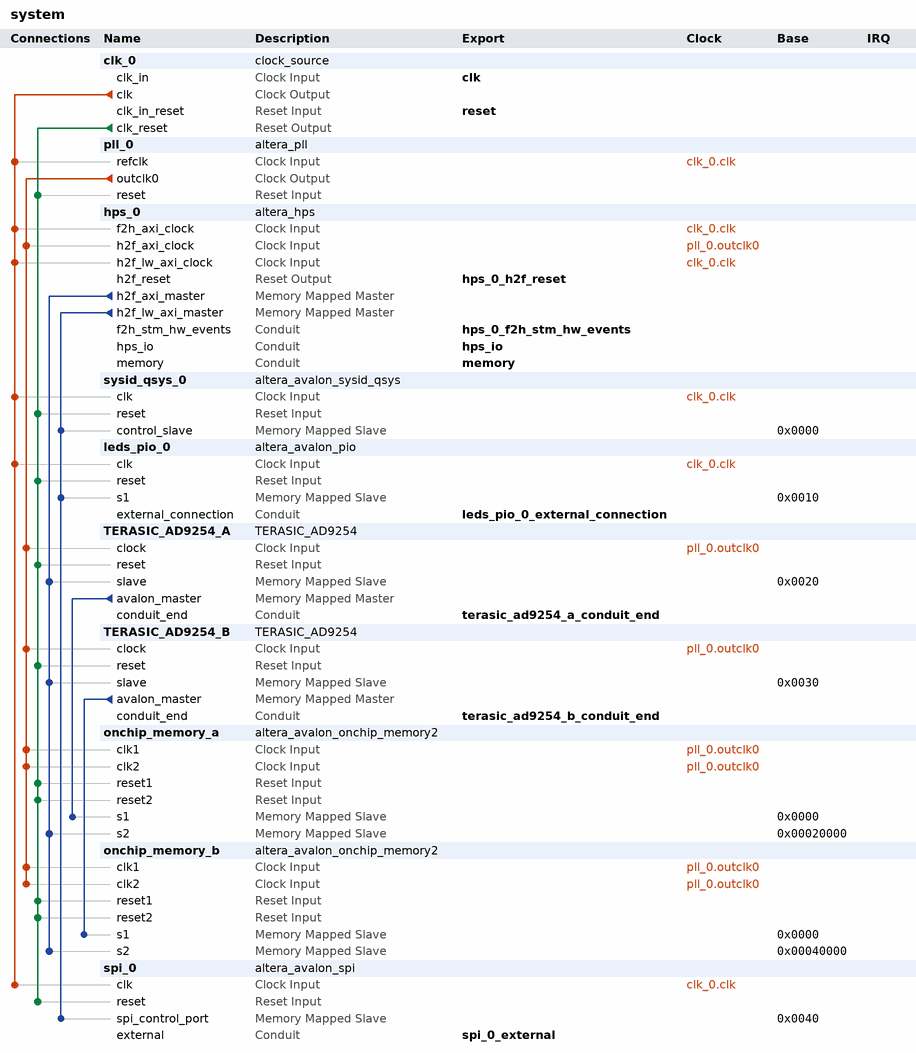
[diagram p0: system contents]
# Platform Designer (Qsys) system system, Cyclone V 5CSEMA4U23C6
# Parameters at their usual value, and those the tool derives, are not listed.
package require -exact qsys 17.1
create_system system
set_project_property DEVICE_FAMILY {Cyclone V}
set_project_property DEVICE 5CSEMA4U23C6

add_instance clk_0 clock_source 17.1
set_instance_parameter_value clk_0 clockFrequency 50000000

add_instance pll_0 altera_pll 17.1
set_instance_parameter_value pll_0 gui_device_speed_grade 2
set_instance_parameter_value pll_0 gui_number_of_clocks 1
set_instance_parameter_value pll_0 gui_operation_mode direct
set_instance_parameter_value pll_0 gui_output_clock_frequency0 100.0
set_instance_parameter_value pll_0 gui_pll_mode {Integer-N PLL}
set_instance_parameter_value pll_0 gui_reference_clock_frequency 50.0
set_instance_parameter_value pll_0 gui_use_locked false

add_instance hps_0 altera_hps 17.1
set_instance_parameter_value hps_0 EMAC1_Mode RGMII
set_instance_parameter_value hps_0 EMAC1_PinMuxing {HPS I/O Set 0}
set_instance_parameter_value hps_0 F2SCLK_COLDRST_Enable false
set_instance_parameter_value hps_0 F2SCLK_DBGRST_Enable false
set_instance_parameter_value hps_0 F2SCLK_WARMRST_Enable false
set_instance_parameter_value hps_0 F2SINTERRUPT_Enable false
set_instance_parameter_value hps_0 F2S_Width 1
set_instance_parameter_value hps_0 FPGA_PERIPHERAL_OUTPUT_CLOCK_FREQ_EMAC0_GTX_CLK 125
set_instance_parameter_value hps_0 FPGA_PERIPHERAL_OUTPUT_CLOCK_FREQ_EMAC0_MD_CLK 2.5
set_instance_parameter_value hps_0 FPGA_PERIPHERAL_OUTPUT_CLOCK_FREQ_EMAC1_GTX_CLK 125
set_instance_parameter_value hps_0 FPGA_PERIPHERAL_OUTPUT_CLOCK_FREQ_EMAC1_MD_CLK 2.5
set_instance_parameter_value hps_0 HPS_PROTOCOL DDR3
set_instance_parameter_value hps_0 I2C0_Mode N/A
set_instance_parameter_value hps_0 I2C0_PinMuxing Unused
set_instance_parameter_value hps_0 I2C1_Mode N/A
set_instance_parameter_value hps_0 I2C1_PinMuxing Unused
set_instance_parameter_value hps_0 LWH2F_Enable true
set_instance_parameter_value hps_0 MEM_BANKADDR_WIDTH 3
set_instance_parameter_value hps_0 MEM_CLK_FREQ 400.0
set_instance_parameter_value hps_0 MEM_COL_ADDR_WIDTH 10
set_instance_parameter_value hps_0 MEM_DQ_WIDTH 32
set_instance_parameter_value hps_0 MEM_DRV_STR RZQ/6
set_instance_parameter_value hps_0 MEM_ROW_ADDR_WIDTH 15
set_instance_parameter_value hps_0 MEM_RTT_NOM RZQ/6
set_instance_parameter_value hps_0 MEM_RTT_WR {Dynamic ODT off}
set_instance_parameter_value hps_0 MEM_TCL 7
set_instance_parameter_value hps_0 MEM_TFAW_NS 37.5
set_instance_parameter_value hps_0 MEM_TRAS_NS 35.0
set_instance_parameter_value hps_0 MEM_TRCD_NS 13.75
set_instance_parameter_value hps_0 MEM_TRFC_NS 300.0
set_instance_parameter_value hps_0 MEM_TRP_NS 13.75
set_instance_parameter_value hps_0 MEM_VENDOR Other
set_instance_parameter_value hps_0 MEM_WTCL 7
set_instance_parameter_value hps_0 QSPI_Mode N/A
set_instance_parameter_value hps_0 QSPI_PinMuxing Unused
set_instance_parameter_value hps_0 REF_CLK_FREQ 25.0
set_instance_parameter_value hps_0 S2FCLK_USER2CLK 5
set_instance_parameter_value hps_0 S2F_Width 1
set_instance_parameter_value hps_0 SDIO_Mode {4-bit Data}
set_instance_parameter_value hps_0 SDIO_PinMuxing {HPS I/O Set 0}
set_instance_parameter_value hps_0 SPIM1_Mode N/A
set_instance_parameter_value hps_0 SPIM1_PinMuxing Unused
set_instance_parameter_value hps_0 STM_Enable true
set_instance_parameter_value hps_0 TIMING_BOARD_AC_SKEW 0.02
set_instance_parameter_value hps_0 TIMING_BOARD_AC_TO_CK_SKEW 0.0
set_instance_parameter_value hps_0 TIMING_BOARD_DQ_TO_DQS_SKEW 0.0
set_instance_parameter_value hps_0 TIMING_BOARD_MAX_CK_DELAY 0.6
set_instance_parameter_value hps_0 TIMING_BOARD_MAX_DQS_DELAY 0.6
set_instance_parameter_value hps_0 TIMING_BOARD_SKEW_BETWEEN_DQS 0.02
set_instance_parameter_value hps_0 TIMING_BOARD_SKEW_CKDQS_DIMM_MAX 0.01
set_instance_parameter_value hps_0 TIMING_BOARD_SKEW_CKDQS_DIMM_MIN -0.01
set_instance_parameter_value hps_0 TIMING_BOARD_SKEW_WITHIN_DQS 0.02
set_instance_parameter_value hps_0 TIMING_TDH 125
set_instance_parameter_value hps_0 TIMING_TDQSCK 400
set_instance_parameter_value hps_0 TIMING_TDQSQ 120
set_instance_parameter_value hps_0 TIMING_TDS 50
set_instance_parameter_value hps_0 TIMING_TIH 250
set_instance_parameter_value hps_0 TIMING_TIS 175
set_instance_parameter_value hps_0 TIMING_TQSH 0.38
set_instance_parameter_value hps_0 UART0_Mode {No Flow Control}
set_instance_parameter_value hps_0 UART0_PinMuxing {HPS I/O Set 0}
set_instance_parameter_value hps_0 USB1_Mode N/A
set_instance_parameter_value hps_0 USB1_PinMuxing Unused
set_instance_parameter_value hps_0 desired_cfg_clk_mhz 100.0
set_instance_parameter_value hps_0 desired_qspi_clk_mhz 400.0

add_instance sysid_qsys_0 altera_avalon_sysid_qsys 17.1
set_instance_parameter_value sysid_qsys_0 id 18351138

add_instance leds_pio_0 altera_avalon_pio 17.1
set_instance_parameter_value leds_pio_0 direction Output
set_instance_parameter_value leds_pio_0 resetValue 170
set_instance_parameter_value leds_pio_0 width 8

add_instance TERASIC_AD9254_A TERASIC_AD9254 1.0

add_instance TERASIC_AD9254_B TERASIC_AD9254 1.0

add_instance onchip_memory_a altera_avalon_onchip_memory2 17.1
set_instance_parameter_value onchip_memory_a dataWidth 16
set_instance_parameter_value onchip_memory_a dualPort true
set_instance_parameter_value onchip_memory_a initMemContent false
set_instance_parameter_value onchip_memory_a initializationFileName onchip_mem.hex
set_instance_parameter_value onchip_memory_a memorySize 100000

add_instance onchip_memory_b altera_avalon_onchip_memory2 17.1
set_instance_parameter_value onchip_memory_b dataWidth 16
set_instance_parameter_value onchip_memory_b dualPort true
set_instance_parameter_value onchip_memory_b initMemContent false
set_instance_parameter_value onchip_memory_b initializationFileName onchip_mem.hex
set_instance_parameter_value onchip_memory_b memorySize 100000

add_instance spi_0 altera_avalon_spi 17.1
set_instance_parameter_value spi_0 clockPolarity 0
set_instance_parameter_value spi_0 dataWidth 8
set_instance_parameter_value spi_0 insertSync true
set_instance_parameter_value spi_0 masterSPI true
set_instance_parameter_value spi_0 numberOfSlaves 2
set_instance_parameter_value spi_0 targetClockRate 128000

# connections
add_connection clk_0.clk hps_0.f2h_axi_clock clock
add_connection clk_0.clk hps_0.h2f_lw_axi_clock clock
add_connection clk_0.clk leds_pio_0.clk clock
add_connection clk_0.clk pll_0.refclk clock
add_connection clk_0.clk spi_0.clk clock
add_connection clk_0.clk sysid_qsys_0.clk clock
add_connection pll_0.outclk0 hps_0.h2f_axi_clock clock
add_connection pll_0.outclk0 onchip_memory_a.clk1 clock
add_connection pll_0.outclk0 onchip_memory_a.clk2 clock
add_connection pll_0.outclk0 onchip_memory_b.clk1 clock
add_connection pll_0.outclk0 onchip_memory_b.clk2 clock
add_connection pll_0.outclk0 TERASIC_AD9254_A.clock clock
add_connection pll_0.outclk0 TERASIC_AD9254_B.clock clock
add_connection clk_0.clk_reset leds_pio_0.reset reset
add_connection clk_0.clk_reset onchip_memory_a.reset1 reset
add_connection clk_0.clk_reset onchip_memory_a.reset2 reset
add_connection clk_0.clk_reset onchip_memory_b.reset1 reset
add_connection clk_0.clk_reset onchip_memory_b.reset2 reset
add_connection clk_0.clk_reset pll_0.reset reset
add_connection clk_0.clk_reset spi_0.reset reset
add_connection clk_0.clk_reset sysid_qsys_0.reset reset
add_connection clk_0.clk_reset TERASIC_AD9254_A.reset reset
add_connection clk_0.clk_reset TERASIC_AD9254_B.reset reset
add_connection hps_0.h2f_axi_master onchip_memory_a.s2 avalon
set_connection_parameter_value hps_0.h2f_axi_master/onchip_memory_a.s2 baseAddress 0x00020000
add_connection hps_0.h2f_axi_master onchip_memory_b.s2 avalon
set_connection_parameter_value hps_0.h2f_axi_master/onchip_memory_b.s2 baseAddress 0x00040000
add_connection hps_0.h2f_axi_master TERASIC_AD9254_A.slave avalon
set_connection_parameter_value hps_0.h2f_axi_master/TERASIC_AD9254_A.slave baseAddress 0x0020
add_connection hps_0.h2f_axi_master TERASIC_AD9254_B.slave avalon
set_connection_parameter_value hps_0.h2f_axi_master/TERASIC_AD9254_B.slave baseAddress 0x0030
add_connection hps_0.h2f_lw_axi_master leds_pio_0.s1 avalon
set_connection_parameter_value hps_0.h2f_lw_axi_master/leds_pio_0.s1 baseAddress 0x0010
add_connection hps_0.h2f_lw_axi_master spi_0.spi_control_port avalon
set_connection_parameter_value hps_0.h2f_lw_axi_master/spi_0.spi_control_port baseAddress 0x0040
add_connection hps_0.h2f_lw_axi_master sysid_qsys_0.control_slave avalon
set_connection_parameter_value hps_0.h2f_lw_axi_master/sysid_qsys_0.control_slave baseAddress 0x0000
add_connection TERASIC_AD9254_A.avalon_master onchip_memory_a.s1 avalon
set_connection_parameter_value TERASIC_AD9254_A.avalon_master/onchip_memory_a.s1 baseAddress 0x0000
add_connection TERASIC_AD9254_B.avalon_master onchip_memory_b.s1 avalon
set_connection_parameter_value TERASIC_AD9254_B.avalon_master/onchip_memory_b.s1 baseAddress 0x0000

# exported interfaces
add_interface clk clock sink
set_interface_property clk EXPORT_OF clk_0.clk_in
add_interface hps_0_f2h_stm_hw_events conduit end
set_interface_property hps_0_f2h_stm_hw_events EXPORT_OF hps_0.f2h_stm_hw_events
add_interface hps_0_h2f_reset reset source
set_interface_property hps_0_h2f_reset EXPORT_OF hps_0.h2f_reset
add_interface hps_io conduit end
set_interface_property hps_io EXPORT_OF hps_0.hps_io
add_interface leds_pio_0_external_connection conduit end
set_interface_property leds_pio_0_external_connection EXPORT_OF leds_pio_0.external_connection
add_interface memory conduit end
set_interface_property memory EXPORT_OF hps_0.memory
add_interface reset reset sink
set_interface_property reset EXPORT_OF clk_0.clk_in_reset
add_interface spi_0_external conduit end
set_interface_property spi_0_external EXPORT_OF spi_0.external
add_interface terasic_ad9254_a_conduit_end conduit end
set_interface_property terasic_ad9254_a_conduit_end EXPORT_OF TERASIC_AD9254_A.conduit_end
add_interface terasic_ad9254_b_conduit_end conduit end
set_interface_property terasic_ad9254_b_conduit_end EXPORT_OF TERASIC_AD9254_B.conduit_end

set_interconnect_requirement {$system} qsys_mm.clockCrossingAdapter HANDSHAKE
set_interconnect_requirement {$system} qsys_mm.enableEccProtection FALSE
set_interconnect_requirement {$system} qsys_mm.insertDefaultSlave FALSE
set_interconnect_requirement {$system} qsys_mm.maxAdditionalLatency 1

save_system system.qsys
